# EAGLE design ballbot (EAGLE 7.2.0)
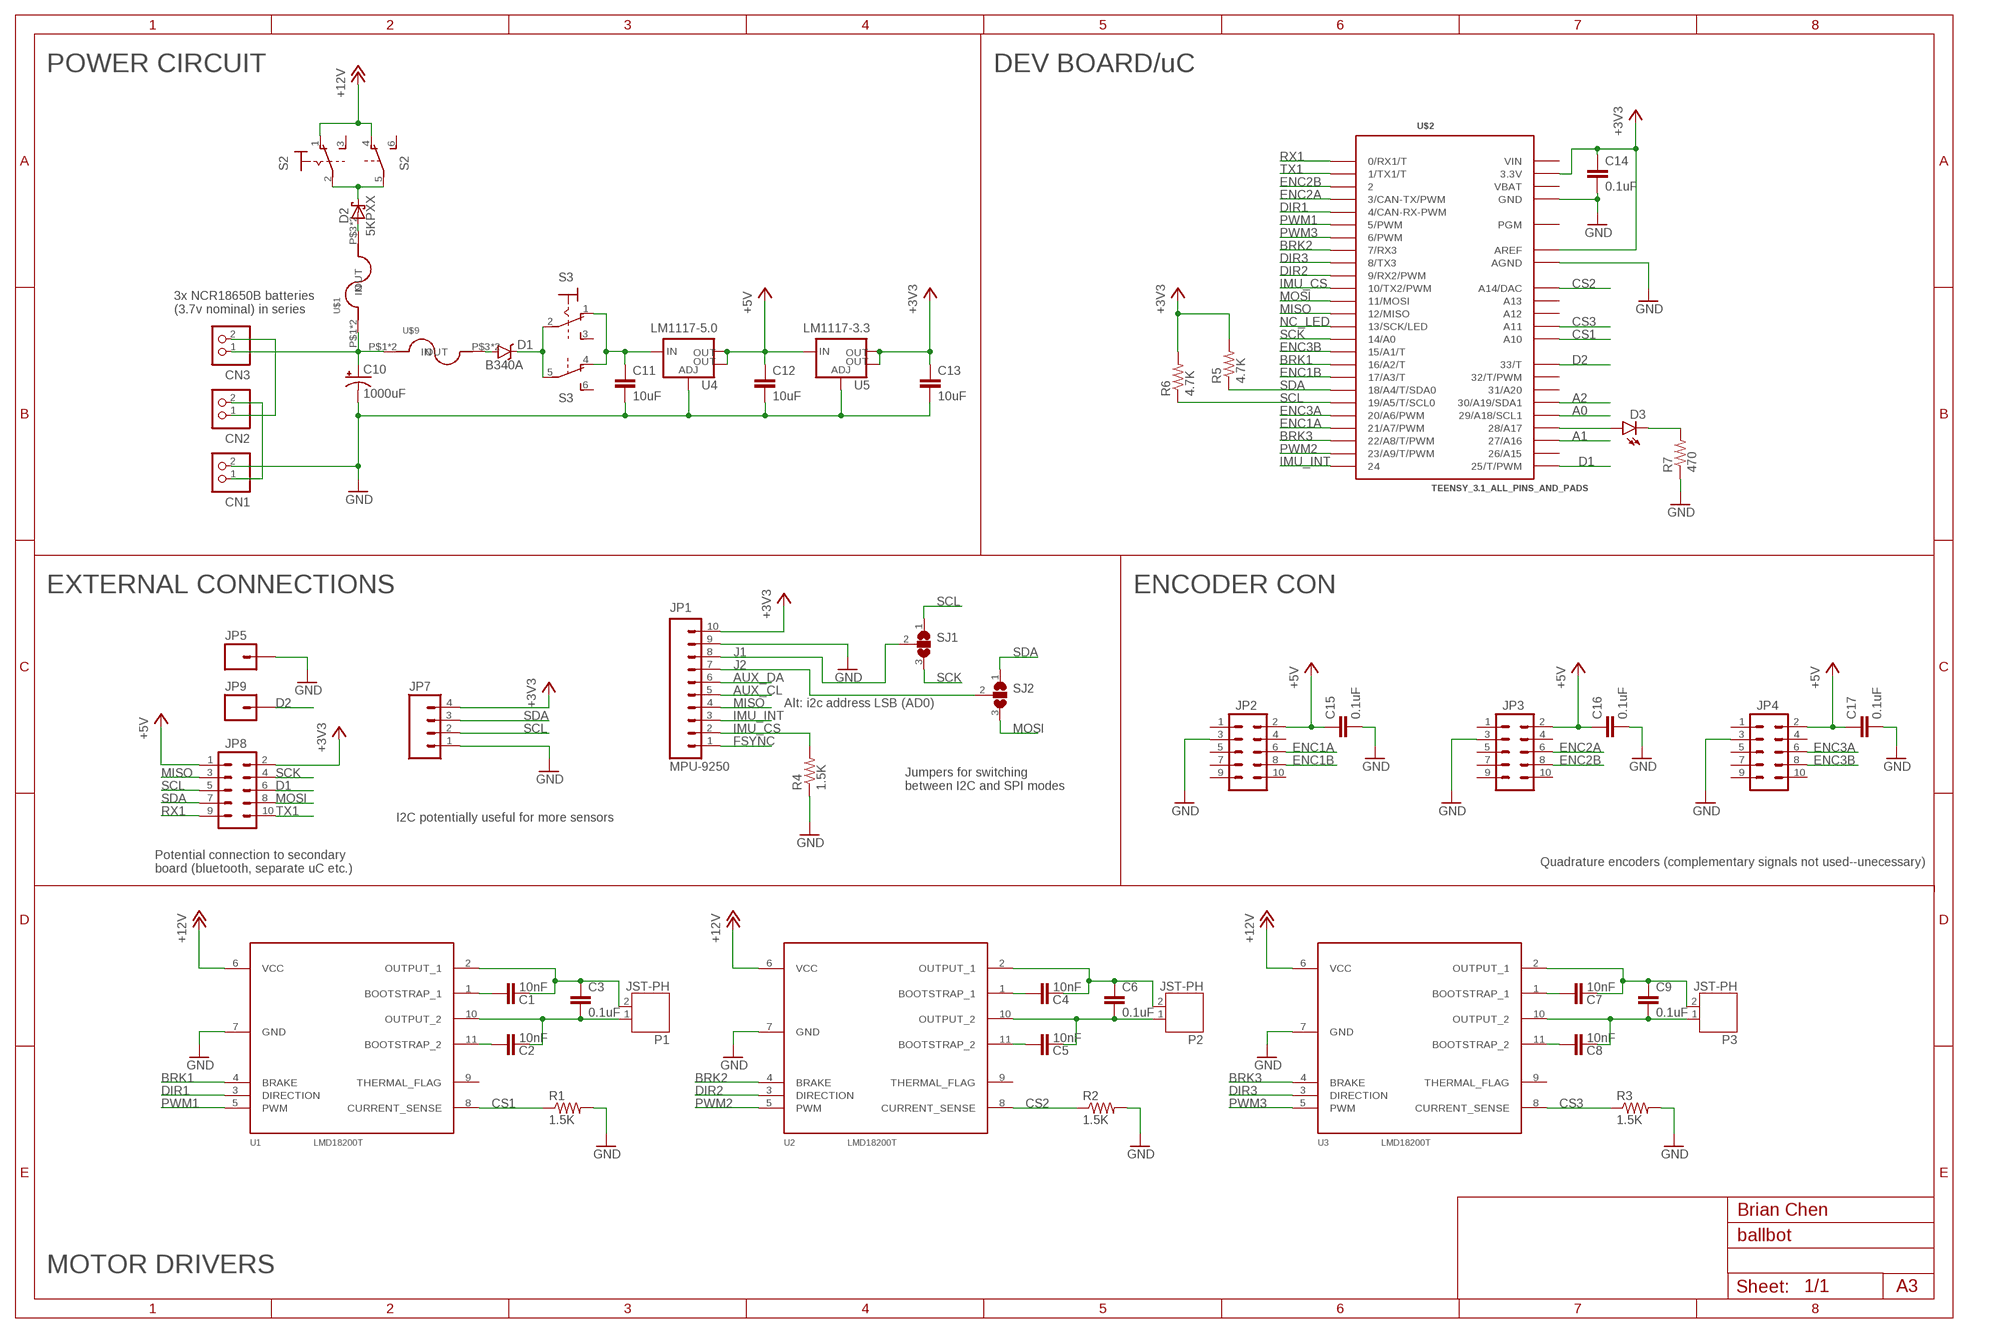
[diagram p0: schematic, sheet 1]

## Parts
C1  10nF  CAP0603-CAP  [0603-CAP]
C2  10nF  CAP0603-CAP  [0603-CAP]
C3  0.1uF  CAP0603-CAP  [0603-CAP]
C4  10nF  CAP0603-CAP  [0603-CAP]
C5  10nF  CAP0603-CAP  [0603-CAP]
C6  0.1uF  CAP0603-CAP  [0603-CAP]
C7  10nF  CAP0603-CAP  [0603-CAP]
C8  10nF  CAP0603-CAP  [0603-CAP]
C9  0.1uF  CAP0603-CAP  [0603-CAP]
C10  1000uF  1000UF-25V(PTH)  [CPOL-RADIAL-1000UF-25V]
C11  10uF  CAP0603-CAP  [0603-CAP]
C12  10uF  CAP0603-CAP  [0603-CAP]
C13  10uF  CAP0603-CAP  [0603-CAP]
C14  0.1uF  CAP0603-CAP  [0603-CAP]
C15  0.1uF  CAP0603-CAP  [0603-CAP]
C16  0.1uF  CAP0603-CAP  [0603-CAP]
C17  0.1uF  CAP0603-CAP  [0603-CAP]
CN1  B2PS-VH  [B2PS-VH]
CN2  B2PS-VH  [B2PS-VH]
CN3  B2PS-VH  [B2PS-VH]
D1  B340A  DIODE-SCHOTTKY-B340A  [SMA-DIODE]
D2  5KPXX  [P6T15]
D3  LED0603  [LED-0603]
JP1  MPU-9250  M10NO_SILK_PTH_FEMALE  [1X10_NO_SILK]
JP2  M05X2SHD  [2X5-SHROUDED]
JP3  M05X2SHD  [2X5-SHROUDED]
JP4  M05X2SHD  [2X5-SHROUDED]
JP5  M01PTH_NO_SILK_YES_STOP  [1X01_NO_SILK]
JP7  M04NO_SILK_ALL_ROUND  [1X04_NO_SILK_ALL_ROUND]
JP8  M05X2NO_SILK  [2X5_NOSILK]
JP9  M01PTH_NO_SILK_YES_STOP  [1X01_NO_SILK]
P1  JST-PH  JST-PH2  [JST-PH2]
P2  JST-PH  JST-PH2  [JST-PH2]
P3  JST-PH  JST-PH2  [JST-PH2]
R1  1.5K  RESISTOR0603-RES  [0603-RES]
R2  1.5K  RESISTOR0603-RES  [0603-RES]
R3  1.5K  RESISTOR0603-RES  [0603-RES]
R4  1.5K  RESISTOR0603-RES  [0603-RES]
R5  4.7K  RESISTOR0603-RES  [0603-RES]
R6  4.7K  RESISTOR0603-RES  [0603-RES]
R7  470  RESISTOR0603-RES  [0603-RES]
S2  320-938  [320-938]
S3  320-938  [320-938]
SJ1  SJ2W  [SJ_2]
SJ2  SJ2W  [SJ_2]
U1  LMD18200T  [TO-220-11]
U2  LMD18200T  [TO-220-11]
U3  LMD18200T  [TO-220-11]
U4  LM1117-5.0  V_REG_LM1117SOT223  [SOT223]
U5  LM1117-3.3  V_REG_LM1117SOT223  [SOT223]
U$1  FUSE_HOLDER_  [KEYSTONE_3568]
U$2  TEENSY_3.1_ALL_PINS_AND_PADS  [TEENSY3_ALL_PINS_&_PADS]
U$9  FUSE_HOLDER_  [KEYSTONE_3568]

## Nets
+3V3: C13.1 C14.1 JP1.10 JP7.4 JP8.2 R5.2 R6.2 U5.2(OUT) U5.4(OUT) U$2.3.3V U$2.3.3V1(3.3V) U$2.3.3V2(3.3V) U$2.AREF
+5V: C12.1 C15.1 C16.1 C17.1 JP2.2 JP3.2 JP4.2 JP8.1 U4.2(OUT) U4.4(OUT) U5.3(IN)
+12V: S2.1(1:O) S2.4(B:O) U1.6(VCC) U2.6(VCC) U3.6(VCC)
A0: U$2.29(29/A18/SCL1)
A1: U$2.27(27/A16)
A2: U$2.30(30/A19/SDA1)
AUX_CL: JP1.5
AUX_DA: JP1.6
BRK1: U1.4(BRAKE) U$2.16/A2(16/A2/T)
BRK2: U2.4(BRAKE) U$2.7(7/RX3)
BRK3: U3.4(BRAKE) U$2.22/A8(22/A8/T/PWM)
CS1: R1.1 U1.8(CURRENT_SENSE) U$2.A10
CS2: R2.1 U2.8(CURRENT_SENSE) U$2.RESET/DAC(A14/DAC)
CS3: R3.1 U3.8(CURRENT_SENSE) U$2.A11
D1: JP8.6 U$2.25(25/T/PWM)
D2: JP9.1 U$2.33(33/T)
DIR1: U1.3(DIRECTION) U$2.4(4/CAN-RX-PWM)
DIR2: U2.3(DIRECTION) U$2.9(9/RX2/PWM)
DIR3: U3.3(DIRECTION) U$2.8(8/TX3)
ENC1A: JP2.6 U$2.21/A7(21/A7/PWM)
ENC1B: JP2.8 U$2.17/A3(17/A3/T)
ENC2A: JP3.6 U$2.3(3/CAN-TX/PWM)
ENC2B: JP3.8 U$2.2
ENC3A: JP4.6 U$2.20/A6(20/A6/PWM)
ENC3B: JP4.8 U$2.15/A1(15/A1/T)
FSYNC: JP1.1
GND: C10.- C11.2 C12.2 C13.2 C14.2 C15.2 C16.2 C17.2 CN1.2 JP1.9 JP2.3 JP3.3 JP4.3 JP5.1 JP7.1 R1.2 R2.2 R3.2 R4.1 R7.1 U1.7(GND) U2.7(GND) U3.7(GND) U4.1(ADJ) U5.1(ADJ) U$2.AGND U$2.GND U$2.GND1(GND) U$2.GND2(GND)
IMU_CS: JP1.2 R4.2 U$2.10(10/TX2/PWM)
IMU_INT: JP1.3 U$2.24
J1: JP1.8 SJ1.2
J2: JP1.7 SJ2.2
MISO: JP1.4 JP8.3 U$2.12(12/MISO)
MOSI: JP8.8 SJ2.3 U$2.11(11/MOSI)
N$1: C1.1 U1.1(BOOTSTRAP_1)
N$2: C2.1 U1.11(BOOTSTRAP_2)
N$3: C4.1 U2.1(BOOTSTRAP_1)
N$4: C5.1 U2.11(BOOTSTRAP_2)
N$5: C7.1 U3.1(BOOTSTRAP_1)
N$6: CN1.1 CN2.2
N$7: CN2.1 CN3.2
N$8: C11.1 S3.1(1:O) S3.4(B:O) U4.3(IN)
N$9: D2.C S2.2(1:P) S2.5(B:P)
N$10: D2.A U$1.P$3(OUT) U$1.P$4(OUT)
N$11: D1.A U$9.P$3(OUT) U$9.P$4(OUT)
N$12: D3.A U$2.28(28/A17)
N$13: D1.C S3.2(1:P) S3.5(B:P)
N$14: D3.C R7.2
N$27: C8.1 U3.11(BOOTSTRAP_2)
NA: C10.+ CN3.1 U$1.P$1(IN) U$1.P$2(IN) U$9.P$1(IN) U$9.P$2(IN)
NC_LED: U$2.13(13/SCK/LED)
OUT_A1: C1.2 C3.1 P1.2 U1.2(OUTPUT_1)
OUT_A2: C4.2 C6.1 P2.2 U2.2(OUTPUT_1)
OUT_A3: C7.2 C9.1 P3.2 U3.2(OUTPUT_1)
OUT_B1: C2.2 C3.2 P1.1 U1.10(OUTPUT_2)
OUT_B2: C5.2 C6.2 P2.1 U2.10(OUTPUT_2)
OUT_B3: C8.2 C9.2 P3.1 U3.10(OUTPUT_2)
PWM1: U1.5(PWM) U$2.5(5/PWM)
PWM2: U2.5(PWM) U$2.23/A9(23/A9/T/PWM)
PWM3: U3.5(PWM) U$2.6(6/PWM)
RX1: JP8.9 U$2.0(0/RX1/T)
SCK: JP8.4 SJ1.3 U$2.14/A0
SCL: JP7.2 JP8.5 R6.1 SJ1.1 U$2.19/A5(19/A5/T/SCL0)
SDA: JP7.3 JP8.7 R5.1 SJ2.1 U$2.18/A4(18/A4/T/SDA0)
TX1: JP8.10 U$2.1(1/TX1/T)
Unconnected: JP2.1 JP2.4 JP2.5 JP2.7 JP2.9 JP2.10 JP3.1 JP3.4 JP3.5 JP3.7 JP3.9 JP3.10 JP4.1 JP4.4 JP4.5 JP4.7 JP4.9 JP4.10 S2.3(1:S) S2.6(B:S) S3.3(1:S) S3.6(B:S) U1.9(THERMAL_FLAG) U2.9(THERMAL_FLAG) U3.9(THERMAL_FLAG) U$2.26(26/A15) U$2.31(31/A20) U$2.32(32/T/PWM) U$2.A12 U$2.A13 U$2.PGM

## Notes on the sheet
- POWER CIRCUIT | DEV BOARD/uC
- 3x NCR18650B batteries
  (3.7v nominal) in series
- EXTERNAL CONNECTIONS | ENCODER CON
- Alt: i2c address LSB (AD0)
- Jumpers for switching 
  between I2C and SPI modes
- I2C potentially useful for more sensors
- Quadrature encoders (complementary signals not used--unecessary)
- Potential connection to secondary 
  board (bluetooth, separate uC etc.)
- Brian Chen
- MOTOR DRIVERS
- A3

## Power pins joined to a net without a drawn wire
VBAT: U$2.VBAT
VIN: U$2.VIN

## Library data of the parts
C1-C9 C11-C17 = SparkFun-Capacitors:CAP: Capacitor Standard 0603 ceramic capacitor, and 0.1" leaded capacitor.
C10 = SparkFun-Capacitors:1000UF-25V(PTH): CAP-08070; PROD_ID: CAP-09538; VALUE: CAP-09538
CN1-CN3 = jst-vh:B2PS-VH: Wire-to-Board 3.96mm pitch top mount connector Source: http://www.jst-mfg.com/product/pdf/jpn/VH.pdf http://www.jst-mfg.com/product/detail.php?series=262
D1 = SparkFun-DiscreteSemi:DIODE-SCHOTTKY: Schottky diodes in SFE's production catalog BAT20J 1A 23V 0.62Vf RB751 120mA 40V 0.37Vf PMEG4005EJ 0.5A 40V 0.42Vf MBRA140 1A 40V 0.5Vf B340A 3A 40V SMA; PROD_ID: DIO-09886
D2 = diode:5KPXX: DIODE transient voltage suppressor
D3 = SparkFun-LED:LED: LEDs Standard schematic elements and footprints for 5mm, 3mm, 1206, and 0603 sized LEDs. 5mm - Spark Fun Electronics SKU : COM-00529 (and others)
JP1 = SparkFun-Connectors:M10: Header 10 Standard 10-pin 0.1" header. Use with straight break away headers (SKU : PRT-00116), right angle break away headers (PRT-00553), swiss pins (PRT-00743), machine pins (PRT-00117), and female headers (PRT-00115).; PROD_ID: CONN-11563
JP2-JP4 JP8 = SparkFun-Connectors:M05X2: Header 5x2 Standard 10-pin dual row 0.1" header. Commonly used with AVR-ISP. Use with Spark Fun Electronics SKU: PRT-00778
JP5 JP9 = SparkFun-Connectors:M01: Header 1 Standard 1-pin 0.1" header. Use with straight break away headers (SKU : PRT-00116), right angle break away headers (PRT-00553), swiss pins (PRT-00743), machine pins (PRT-00117), and female headers (PRT-00115).
JP7 = SparkFun-Connectors:M04: Header 4 Standard 4-pin 0.1" header. Use with straight break away headers (SKU : PRT-00116), right angle break away headers (PRT-00553), swiss pins (PRT-00743), machine pins (PRT-00117), and female headers (PRT-00115). Molex polarized connector foot print use with SKU : PRT-08231 with associated crimp pins and housings. 1MM SMD Version SKU: PRT-10208
P1-P3 = jst-ph:JST-PH2
R1-R7 = SparkFun-Passives:RESISTOR: Resistor Basic schematic elements and footprints for 0603, 1206, and PTH resistors.
S2 S3 = SWITCH DPDT MTS-202:320-938: TOGGLE SWITCH distributor RS Components
SJ1 SJ2 = jumper:SJ2W: SMD solder JUMPER
U1-U3 = lmd1820x:LMD18200: National Semiconductor LMD18200 3A, 55V H-Bridge
U4 U5 = SparkFun-PowerIC:V_REG_LM1117: Voltage Regulator LM1117 Standard adjustable voltage regulator but in SMD form. Spark Fun Electronics SKU : COM-00595; PROD_ID: VREG-08170
U$1 U$9 = Andrew:FUSE_HOLDER
U$2 = Teensy_3_NOVBAT:TEENSY_3.1_ALL_PINS_AND_PADS: Footprint for Teensy 3.1 or 3.2 board using all pads and all through-holes. Pads need a 2x7 0.1" SMD header.

## Board
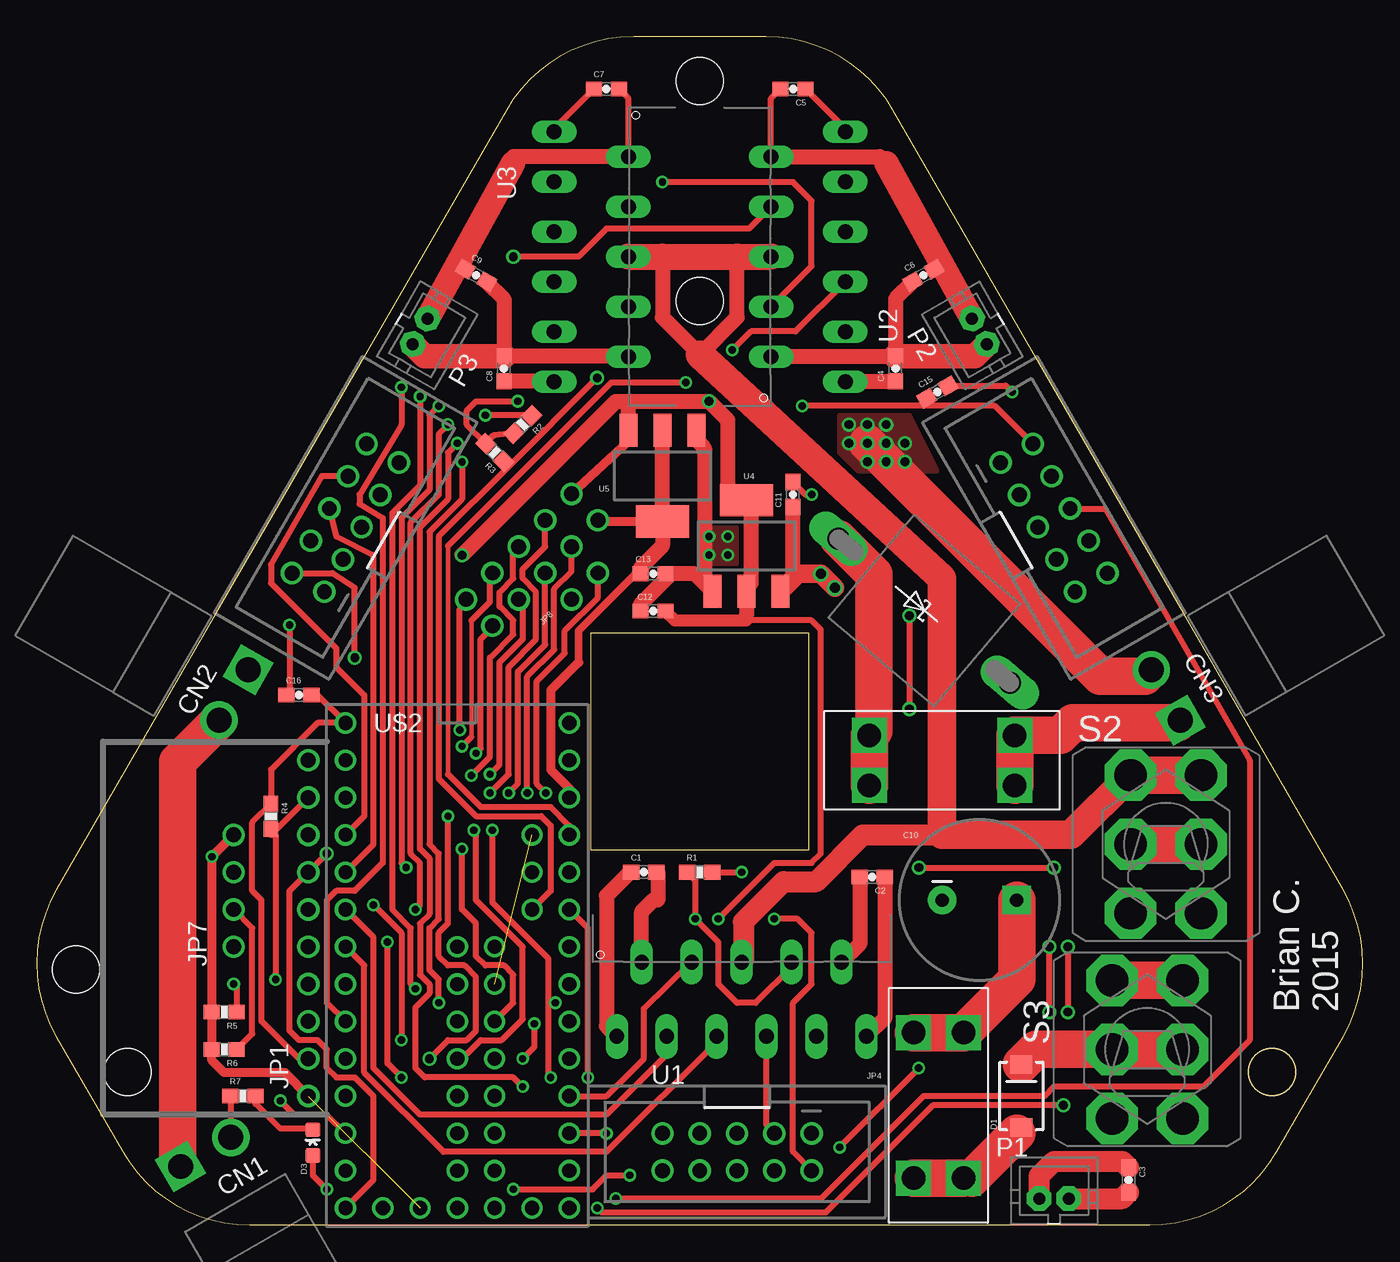
[diagram p1: board, top side]
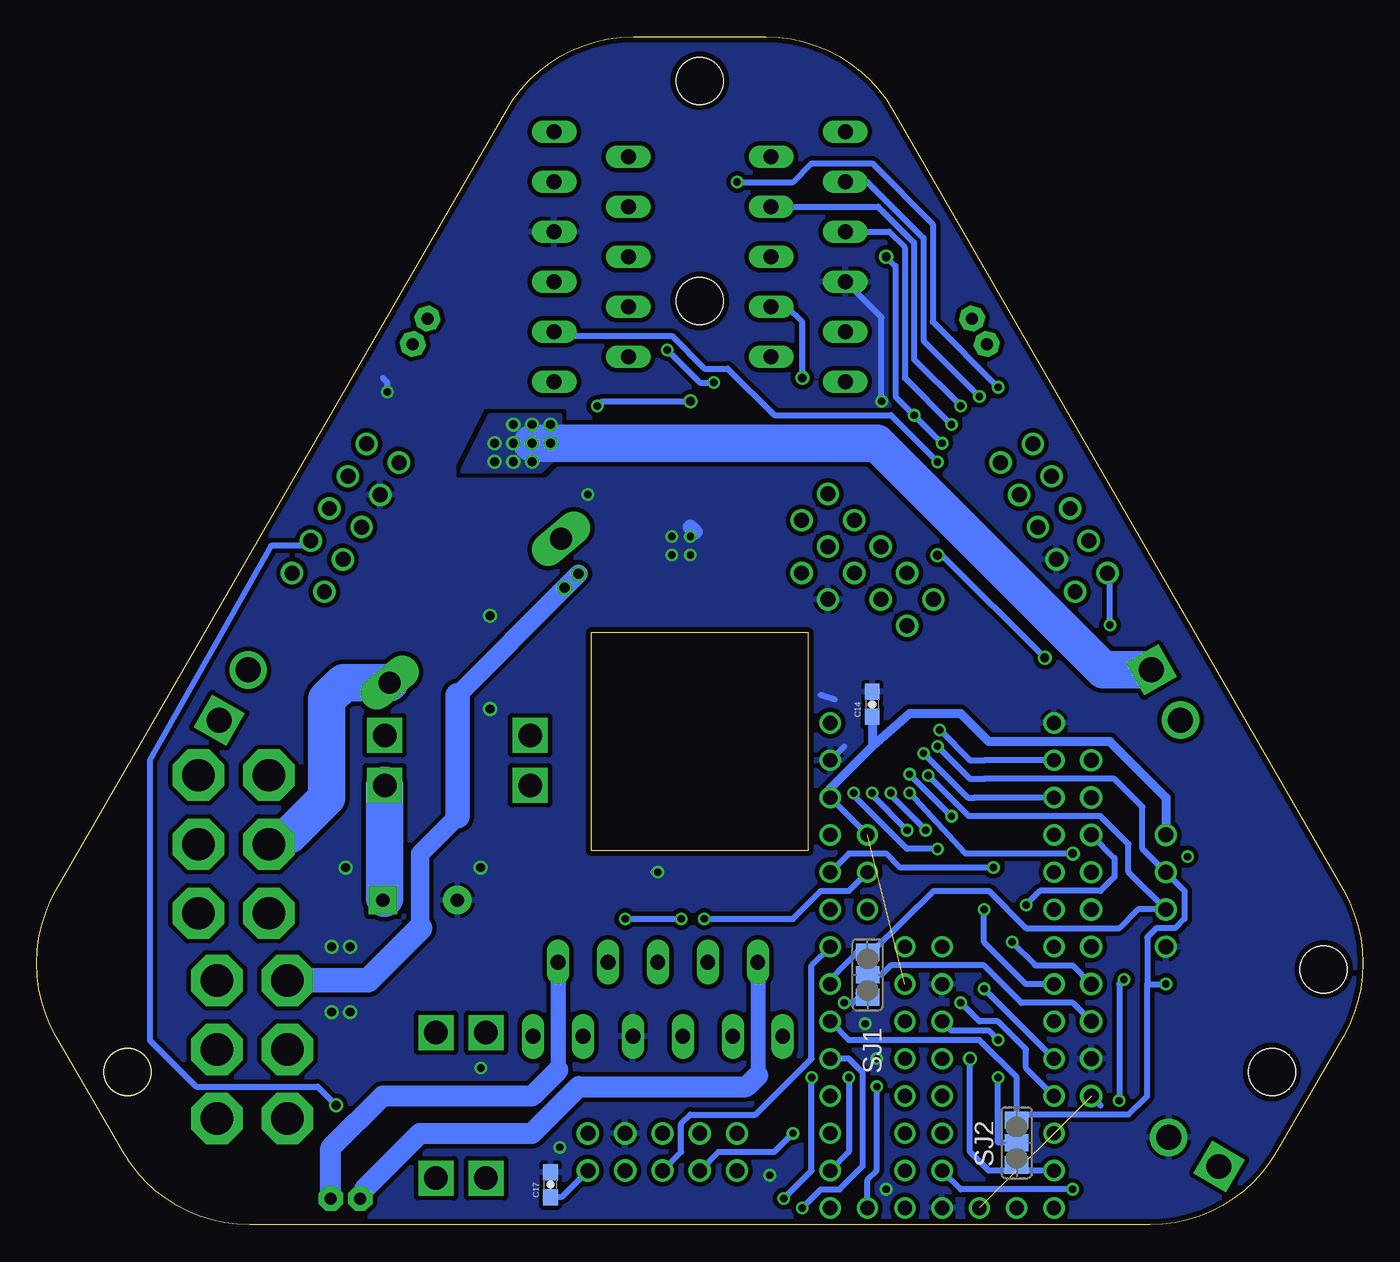
[diagram p2: board, bottom side, seen from below]

Size 90.33 x 80.91 mm. Coordinates in mm from the lower left corner, seen from the top.
Outline: 52.56,25.51 37.76,25.51 37.76,40.31 52.56,40.31 52.56,25.51
Outline: 1.34,12.81 5.85,5 arc60 14.51,0 75.82,0 arc60 84.48,5 88.99,12.81 arc60 88.99,22.81 58.34,75.91 arc60 49.68,80.91 40.65,80.91 arc60 31.99,75.91 1.34,22.81 arc60 1.34,12.81
Outline: circle at 84.14,10.41 radius 1.6
Copper layers (1*16): Top 0.0356mm / dielectric 1.5011mm / Bottom 0.0356mm
Design rules "LaenPCBOrder *": minimum track width 6mil, minimum drill 13mil, track to track 8mil, track to pad 8mil, pad to pad 8mil, via to via 8mil, smd to smd 8mil, copper to edge 15mil, drill to drill 6mil, minimum pad ring 7mil, minimum via ring 7mil, stop-mask expansion 3mil, vias tented up to drill 24mil, thermal gap 10mil
Holes 3.2 mm at 45.16,77.91 6.19,10.41 84.14,10.41 45.16,62.91 2.66,17.41

### Footprints (pad centres in the part's own frame; a part is rotated, then mirrored left to right if it is on the bottom)
0603-CAP = smd 1.1 x 1: 1 -0.85,0; 2 0.85,0
CPOL-RADIAL-1000UF-25V = drill 0.9 pad 1.93 square: + 2.54,0 | drill 0.9 pad 1.93: - -2.54,0
B2PS-VH = drill 1.7 square: 1 1.98,0 | drill 1.7: 2 -1.98,0
SMA-DIODE = smd 1.27 x 1.47: A -2.15,0; C 2.15,0
P6T15 = drill 1.499 long: A 7.62,0; C -7.62,0
LED-0603 = smd 1 x 1: A 0,-0.877; C 0,0.877
1X10_NO_SILK = drill 1.016: 1 0,0; 2 2.54,0; 3 5.08,0; 4 7.62,0; 5 10.16,0; 6 12.7,0; 7 15.24,0; 8 17.78,0; 9 20.32,0; 10 22.86,0
2X5-SHROUDED = drill 1.016: 1 -1.27,5.08; 2 1.27,5.08; 3 -1.27,2.54; 4 1.27,2.54; 5 -1.27,0; 6 1.27,0; 7 -1.27,-2.54; 8 1.27,-2.54; 9 -1.27,-5.08; 10 1.27,-5.08
1X01_NO_SILK = drill 1.016: 1 0,0
1X04_NO_SILK_ALL_ROUND = drill 1.016: 1 0,0; 2 2.54,0; 3 5.08,0; 4 7.62,0
2X5_NOSILK = drill 1.016: 1 -1.27,5.08; 2 1.27,5.08; 3 -1.27,2.54; 4 1.27,2.54; 5 -1.27,0; 6 1.27,0; 7 -1.27,-2.54; 8 1.27,-2.54; 9 -1.27,-5.08; 10 1.27,-5.08
JST-PH2 = drill 0.813 pad 1.676 octagon: 1 1,0; 2 -1,0
0603-RES = smd 1.1 x 1: 1 -0.85,0; 2 0.85,0
320-938 = drill 2.2 pad 3.5 octagon: 1 -2.4,4.7; 2 -2.4,0; 3 -2.4,-4.7; 4 2.4,4.7; 5 2.4,0; 6 2.4,-4.7
SJ_2 = smd 1.168 x 1.6: 1 -1.524,0; 2 0,0; 3 1.524,0
TO-220-11 = drill 1.016 long: 1 -8.509,-2.292; 2 -6.807,2.762; 3 -5.105,-2.292; 4 -3.404,2.762; 5 -1.702,-2.292; 6 0,2.762; 7 1.702,-2.292; 8 3.404,2.762; 9 5.105,-2.292; 10 6.807,2.762; 11 8.509,-2.292
SOT223 = smd 1.219 x 2.235: 1 -2.311,-3.099; 2 0,-3.099; 3 2.311,-3.099 | smd 3.6 x 2.2: 4 0,3.099
KEYSTONE_3568 = drill 1.6 square: P$1 -4.953,1.702; P$2 -4.953,-1.702; P$3 4.953,1.702; P$4 4.953,-1.702
TEENSY3_ALL_PINS_&_PADS = drill 0.965: 0 -7.62,13.97; 1 -7.62,11.43; 2 -7.62,8.89; 3 -7.62,6.35; 3.3V 7.62,11.43; 3.3V1 -2.54,-16.51; 3.3V2 2.54,-1.27; 4 -7.62,3.81; 5 -7.62,1.27; 6 -7.62,-1.27; 7 -7.62,-3.81; 8 -7.62,-6.35; 9 -7.62,-8.89; 10 -7.62,-11.43; 11 -7.62,-13.97; 12 -7.62,-16.51; 13 7.62,-16.51; 14/A0 7.62,-13.97; 15/A1 7.62,-11.43; 16/A2 7.62,-8.89; 17/A3 7.62,-6.35; 18/A4 7.62,-3.81; 19/A5 7.62,-1.27; 20/A6 7.62,1.27; 21/A7 7.62,3.81; 22/A8 7.62,6.35; 23/A9 7.62,8.89; 24 0,-3.81; 25 0,-6.35; 26 0,-8.89; 27 0,-11.43; 28 0,-13.97; 29 2.54,-13.97; 30 2.54,-11.43; 31 2.54,-8.89; 32 2.54,-6.35; 33 2.54,-3.81; A10 5.08,6.35; A11 5.08,3.81; A12 0,1.27; A13 2.54,1.27; AGND 7.62,13.97; AREF 5.08,8.89; GND -7.62,16.51; GND1 0,-16.51; GND2 0,-1.27; PGM 2.54,-16.51; RESET/DAC 5.08,-16.51; VBAT -5.08,-16.51; VIN 7.62,16.51

### Placement (x,y rotation side)
C1  41.35,24.02 0 top
C2  56.91,23.7 180 top
C3  74.37,3.06 270 top
C4  58.5,58.31 90 top
C5  51.51,77.36 180 top
C6  60.4,64.66 30 top
C7  38.81,77.36 0 top
C8  31.83,58.31 90 top
C9  29.92,64.66 330 top
C10  64.21,22.11 0 top
C11  51.51,49.73 90 top
C12  41.99,41.8 180 top
C13  41.99,44.34 0 top
C14  33.42,35.45 90 bottom
C15  61.36,56.72 30 top
C16  17.86,36.08 0 top
C17  55.32,2.74 90 bottom
CN1  11.51,4.97 210 top
CN2  13.41,36.08 60 top
CN3  76.91,36.08 300 top
D1  67.07,8.78 90 top
D2  60.46,41.83 140 top
D3  18.81,5.6 0 top
JP1  18.49,31.64 270 top
JP2  69.29,48.15 30 top
JP3  21.03,48.15 150 top
JP4  47.7,4.97 270 top
JP5  36.43,42.6 315 top
JP7  13.41,18.94 90 top
JP8  33.73,45.29 315 top
JP9  38.22,44.39 315 top
P1  69.29,1.79 0 top
P2  64.21,60.85 120 top
P3  26.11,60.85 240 top
R1  45.16,24.02 0 top
R2  33.1,54.5 225 top
R3  31.19,52.59 135 top
R4  15.95,27.83 270 top
R5  12.78,14.49 180 top
R6  12.78,11.95 180 top
R7  14.05,8.78 0 top
S2  76.91,25.92 0 top
S3  75.64,11.95 0 top
SJ1  33.73,17.03 270 bottom
SJ2  23.57,5.6 270 bottom
U1  48.02,15.13 0 top
U2  52.78,65.93 90 top
U3  37.54,65.93 270 top
U4  48.34,46.24 0 top
U5  42.62,51 180 top
U$1  61.67,31.64 180 top
U$2  28.65,17.67 0 top
U$9  61.43,8.14 270 top

### Tracks (layer width: path | path; a pad name or v marks a point on that pad's centre or on a via)
+3V3  (via drill 0.5)  (2 unrouted)
  Top 0.406: JP8.2 38.3,47.9
  Top 0.508: 40.8,44.34 36.91,40.45 36.91,38.3
  Top 0.61: JP7.4 v11.93,25.07 R5.2 R6.2 11.93,11.21 12.78,10.36 16.91,10.36 JP1.10 | 38.3,47.9 U5.4 | C13.1 40.8,44.34 | 36.91,38.3 35,36.4 35,31 36.27,29.73 U$2.3.3V
  Top 1.016: U5.2 U5.4 42.62,46.24 41.14,44.76 C13.1
  Bottom 0.406: U$2.3.3V U$2.AREF | 17.86,8.14 JP1.10
  Bottom 0.61: JP7.4 13.41,29.1 17.22,32.91 25.48,32.91 27.38,34.81 30.88,34.81 33.42,32.59 | 33.42,32.59 36.27,29.73 U$2.3.3V | C14.1 33.42,32.59
+5V  (via drill 0.5, 0.6)
  Top 0.406: JP2.2 65.27,55.77 60.4,55.77 | 60.4,55.77 v52.15,55.77 | v21.67,38.62 21.67,43.38 20.13,44.38 JP3.2 | JP4.2 51.51,4.97 51.51,15.13 52.78,16.4 52.78,19.89 51.83,20.84 v50.24,20.84 | v46.43,20.84 50.24,24.65 52.78,24.65 53.42,25.29 53.42,40.53 52.78,41.16 48.34,41.16 48.34,41.48 | C15.1 60.3,55.98 60.4,55.77 | v17.22,40.84 17.22,36.18 C16.1
  Top 0.61: JP8.1 40.31,53.35 U5.3
  Top 0.813: 48.34,41.16 43.47,41.16 C12.1
  Top 1.016: 40.3,56.08 v45.8,56.08 47.07,54.81 47.07,49.42 48.26,49.42 U4.4 48.66,49.02 48.66,43.7 48.34,43.38 U4.2 48.34,41.48 | v28.97,45.61 39.45,56.08 40.3,56.08 | U5.3 40.3,53.8 40.3,56.08
  Bottom 0.406: v52.15,55.77 51.83,56.08 v45.8,56.08 | v28.97,45.61 28.65,45.61 v21.67,38.62 | v50.24,20.84 v46.43,20.84 | JP4.2 54.59,1.89 C17.1 | v17.22,40.84 17.22,44.21 JP3.2
+12V
  Top 1.016: 42.62,65.93 42.62,61.8 45.16,59.26 47.7,61.8 47.7,65.93
  Top 1.422: 61.67,26.56 56.28,26.56 53.1,23.38 50.88,23.38 48.13,20.63 48.13,18 U1.6
  Top 1.778: U3.6 42.62,65.93 47.7,65.93 U2.6
  Top 1.93: S2.1 70.45,26.56 61.67,26.56 61.67,44.02 45.16,59.26
  Top 2.54: S2.4 S2.1
BRK1
  Top 0.406: U$2.16/A2 38.81,8.78 41.35,11.32 41.35,14.73 U1.4
BRK2  (via drill 0.5)
  Top 0.406: U2.4 52.78,65.29 52.78,69.74 51.51,71.01 v42.62,71.01 | v24.84,57.04 24.84,54.5 21.99,49.73 21.99,49.1 23.57,48.15 23.57,24.65 21.67,22.75 20.4,22.75 19.76,22.11 19.76,15.13 U$2.7
  Bottom 0.406: v42.62,71.01 38.81,71.01 37.54,72.28 33.42,72.28 29.29,68.15 29.29,61.48 v24.84,57.04
BRK3  (via drill 0.5)
  Top 0.406: v27.38,55.77 26.75,55.13 26.75,50.05 24.84,48.15 24.84,24.65 v25.16,24.33
  Bottom 0.406: U3.4 33.01,69.33 30.56,66.88 30.56,58.94 v27.38,55.77 | v25.16,24.33 31.51,24.33 32.46,25.29 35,25.29 U$2.22/A8
CS1  (via drill 0.5)
  Top 0.406: U1.8 51.53,17.69 48.97,15.13 47.7,15.13 46.43,16.4 46.43,19.25 v44.85,20.84 44.85,23.48 R1.1
  Bottom 0.406: v44.85,20.84 38.81,20.84 36.91,22.75 35,22.75 U$2.A10
CS2  (via drill 0.5, 0.6)
  Top 0.406: U2.8 48.52,67.83 38.81,67.83 36.91,65.93 v32.46,65.93 | v28.65,53.23 28.02,52.59 28.02,49.42 26.11,47.51 26.11,25.6 26.75,24.97 26.75,21.16 26.11,20.52 26.11,17.03 26.75,16.4 26.75,15.76 25.8,14.81 25.8,10.68 26.43,10.05 32.46,10.05 v33.1,9.41 | R2.1 33.67,55.13 v30.56,55.13
  Bottom 0.406: v32.46,65.93 31.83,65.29 31.83,56.4 v30.56,55.13 v28.65,53.23 | U$2.RESET/DAC 33.73,3.06 33.1,3.7 v33.1,9.41
CS3  (via drill 0.6)
  Top 0.406: v38.18,57.67 32.15,51.64 | 32.15,51.64 27.38,46.88 27.38,30.37 29.92,27.83 34.37,27.83 35,27.19 35,22.75 U$2.A11 | R3.1 32.15,51.64
  Bottom 0.406: v38.18,57.67 38.18,61.48 39.22,62.52 U3.8
D1  (via drill 0.5)
  Top 0.406: v29.77,26.87 29.92,26.72 29.92,22.11 33.1,18.94 33.1,14.02 31.67,12.59 30.24,12.59 28.97,11.32 U$2.25 | v32.15,29.41 32.78,30.05 32.78,37.67 34.63,39.52 JP8.6
  Bottom 0.406: v29.77,26.87 32.15,29.26 v32.15,29.41
D2  (via drill 0.5)
  Top 0.406: U$2.33 32.46,15.13 32.46,17.03 31.83,17.67 30.56,17.67 29.92,18.3 29.92,20.52 28.97,21.48 v28.97,25.6 | v34.69,29.41 34.05,30.05 34.05,37.03 35.96,38.94 35.96,40.45 38.22,42.71 JP9.1
  Bottom 0.406: v28.97,25.6 31.04,25.6 34.69,29.26 v34.69,29.41
DIR1
  Top 0.406: U1.3 43.02,11.72 38.81,7.51 26.11,7.51 22.94,10.68 22.94,19.57 U$2.4
DIR2  (via drill 0.5)
  Top 0.406: v28.97,51.96 28.97,49.42 26.75,47.19 26.75,25.92 27.38,25.29 27.38,20.84 26.75,20.21 26.75,17.35 27.38,16.71 v27.38,15.13
  Bottom 0.406: U2.3 55.05,60.85 54.69,60.53 47.07,60.53 44.85,58.31 43.26,58.31 40.08,55.13 32.15,55.13 v28.97,51.96 | U$2.9 22.94,10.68 22.94,11.95 24.84,13.86 26.11,13.86 v27.38,15.13
DIR3  (via drill 0.5)
  Top 0.406: v26.11,56.4 26.11,50.37 24.21,48.46 24.21,21.48 25.48,20.21 25.48,16.4 v25.8,16.08
  Bottom 0.406: U3.3 35.23,71.01 33.73,71.01 29.92,67.2 29.92,60.21 v26.11,56.4 | U$2.8 v25.8,16.08
ENC1A  (via drill 0.5)
  Top 0.406: JP2.6 72.79,48.78 82.63,31.64 82.63,12.59 79.45,9.41 69.29,9.41 68.66,8.78 60.4,8.78 53.42,1.79 v39.45,1.79 | v37.54,10.05 37.54,20.21 U$2.21/A7
  Bottom 0.406: v39.45,1.79 37.54,3.7 v37.54,10.05
ENC1B  (via drill 0.5, 0.6)
  Top 0.406: v69.93,8.14 61.04,8.14 53.74,0.84 38.5,0.84 v38.18,1.16
  Bottom 0.406: JP2.8 72,46.24 74.37,46.24 82.63,31.64 82.63,12.59 79.45,9.41 71.2,9.41 v69.93,8.14 | v38.18,1.16 36.91,2.43 35.64,2.43 34.05,4.01 34.05,10.36 35,11.32 U$2.17/A3
ENC2A
  Top 0.406: JP3.6 20.4,46.88 22.94,45.61 22.94,25.92 U$2.3
ENC2B
  Top 0.406: JP3.8 19.42,50.98 15.95,44.97 15.95,43.7 20.4,39.26 20.4,37.99 22.3,36.08 22.3,27.83 U$2.2
ENC3A
  Bottom 0.406: JP4.6 46.43,4.97 46.43,6.87 45.8,7.51 41.35,7.51 37.54,11.32 37.54,17.67 U$2.20/A6
ENC3B  (via drill 0.5)
  Top 0.406: v38.81,6.24 U$2.15/A1
  Bottom 0.406: JP4.8 43.89,4.97 40.08,4.97 v38.81,6.24
GND  (via drill 0.5, 0.6)
  Top 0.254: v45.8,45.61 45.48,45.29 45.48,44.65
  Top 0.406: JP4.3 49.72,6.76 U1.7 | R3.2 31.16,53.76 R2.2 31.09,53.76 30.56,53.23 29.29,54.5 29.29,55.45 29.92,56.08 v32.78,56.08 | JP1.9 17.86,11.32 15.32,13.86 15.32,22.11 14.68,22.75 14.68,27.41 R4.1 15.95,31 19.13,34.18 U$2.GND 19.13,36.08 C16.2 | C15.2 66.01,57.14 v66.44,56.72 | C11.2 52.36,49.73 v52.78,49.73 | R1.2 v48.02,24.02 | v33.89,13.7 33.89,12.11 v33.1,11.32 | v32.46,2.43 37.86,2.43 38.81,3.38 v40.4,3.38 | v54.69,5.28 v60.09,10.68 | R7.1 13.22,8.43 CN1.2 | v60.09,24.33 v69.29,24.33 | v68.98,14.49 v68.98,18.94 | v70.25,18.94 v70.25,14.49 | v59.45,41.48 v59.45,35.13
  Top 1.016: U4.1 45.48,43.69 | U5.1 44.94,53.46 45.48,52.91 45.48,44.65 45.48,43.69 | 45.48,43.69 44.83,44.34 C13.2 43,44.13 41.14,42.27 C12.2
  Bottom 0.406: v32.78,56.08 32.78,61.8 35,64.02 | v66.44,56.72 66.44,57.35 66.75,57.67 | 35.96,35.76 36.91,36.08 | v48.02,24.02 48.34,24.02 | U$2.AGND 35.32,32.59
  Bottom 1.016: 45.48,47.19 45.8,47.51
  other vias: 45.8,46.88 47.07,46.88 47.07,45.61
  pour Bottom (isolate 0.305, rank 2): -9.45,86.25 98.5,86.25 99.77,-5.19 -9.45,-5.19
  pour Top: 45.16,47.51 47.7,47.51 47.7,44.97 45.16,44.97
IMU_CS  (via drill 0.5)
  Top 0.406: JP1.2 15.95,26.56 | 15.95,26.56 16.27,26.56 v16.27,16.71 | R4.2 15.95,26.56 | U$2.10 19.76,7.51 17.54,7.51 v16.59,8.46
  Bottom 0.406: v16.27,16.71 16.59,16.4 v16.59,8.46
IMU_INT  (via drill 0.5)
  Top 0.406: v22.94,21.79 24.84,19.89 v24.84,12.59
  Bottom 0.406: v24.84,12.59 25.48,13.22 28.02,13.22 U$2.24 | JP1.3 16.91,24.97 16.91,23.7 17.86,22.75 21.99,22.75 v22.94,21.79
J1
  Bottom 0.406: JP1.8 19.76,15.13 23.26,15.13 25.8,17.67 32.15,17.67 32.78,17.03 SJ1.2
J2  (via drill 0.5)
  Top 0.406: v24.84,10.05 23.89,11 v23.89,19.25
  Bottom 0.406: SJ2.2 24.84,5.6 v24.84,10.05 | v23.89,19.25 22.3,17.67 19.76,17.67 JP1.7
MISO  (via drill 0.5, 0.6)
  Top 0.406: U$2.12 22.94,3.06 22.94,8.78 21.67,10.05 20.4,10.05 19.76,10.68 19.76,11.95 19.13,12.59 17.86,12.59 17.22,13.22 17.22,22.75 JP1.4 v19.76,25.29 | v30.88,29.41 32.15,30.68 32.15,37.99 34.01,39.89 34.01,43.07 33.1,44.02 33.1,44.65 34.63,46.19 JP8.3
  Bottom 0.406: v19.76,25.29 27.07,25.29 v30.88,29.41
MOSI  (via drill 0.5, 0.6)
  Top 0.406: v26.75,11.32 28.02,12.59 29.29,12.59 29.92,13.22 29.92,16.87 29.13,17.67 28.02,17.67 27.38,18.3 27.38,19.89 28.02,20.52 v28.02,27.83 | v30.88,30.68 31.51,31.32 31.51,38.3 33.1,39.89 33.1,42.43 32.94,42.59 JP8.8
  Bottom 0.406: U$2.11 23.32,3.7 SJ2.3 23.96,3.7 25.48,3.7 26.75,4.97 v26.75,11.32 | v30.88,30.68 v28.02,27.83
N$1
  Top 1.016: C1.1 40.4,24.02 38.81,22.43 38.81,13.53 U1.1
N$2
  Top 1.016: C2.1 57.76,14.07 U1.11
N$3
  Top 1.016: U2.1 55.12,57.46 C4.1
N$4
  Top 0.406: U2.11 55.08,74.64 C5.1
N$5
  Top 0.406: U3.1 35.25,74.64 C7.1
N$6
  Top 2.54: CN2.2 9.6,31.55 9.6,4.33 CN1.1
N$7  (via drill 0.6)
  Top 2.54: v56.59,53.23 72.47,37.35 75.48,37.35 CN3.2
  Bottom 2.54: v56.59,53.23 33.1,53.23 17.67,37.8 CN2.1
  other vias: 55.32,54.5 55.32,53.23 59.13,53.23 57.86,51.96 57.86,53.23 57.86,54.5 56.59,54.5 56.59,51.96 59.13,51.96
  pour Top: 59.45,55.13 61.36,51.32 55.96,51.32 54.69,52.59 54.69,55.13
  pour Bottom: 54.69,55.13 54.69,52.59 55.96,51.32 61.36,51.32 59.45,55.13
N$8  (via drill 0.7)
  Top 1.016: U4.3 51.51,44.01 C11.1
  Top 1.27: v54.37,43.38 v53.42,44.34 51.84,44.34 U4.3
  Top 2.54: S3.1 S3.4
  Bottom 1.27: 64.21,20.21 64.21,25.29 61.67,27.83 | 61.67,36.08 v54.37,43.38 v53.42,44.34
  Bottom 1.676: S3.1 67.77,16.65 64.21,20.21 | 61.67,27.83 61.67,36.08
N$9
  Top 2.54: S2.5 S2.2
  Bottom 2.54: S2.2 73.1,26.56 70.56,29.1 70.56,35.78 69.41,36.93 D2.C
N$10
  Top 1.016: 56.59,33.47 U$1.P$4
  Top 2.54: U$1.P$3 U$1.P$4 57.04,33.66 57.04,44.3 D2.A
N$11
  Top 1.016: U$9.P$3 63.7,3.18 | 66.75,6.24 D1.A
  Top 2.54: U$9.P$3 U$9.P$4 | 63.7,3.18 66.75,6.24
N$12  (via drill 0.5)
  Top 0.406: D3.A 18.81,3.38 v19.76,2.43
  Bottom 0.406: v19.76,2.43 27.38,2.43 U$2.28
N$13
  Top 2.54: D1.C 68.1,11.95 S3.2 S3.5
N$14
  Top 0.406: 18.78,6.45 D3.C 18.74,6.55 16.59,6.55 14.9,8.24 R7.2
N$27
  Top 1.016: U3.11 35.21,57.46 C8.1
NA
  Top 2.54: U$9.P$2 U$9.P$1 66.75,16.72 C10.+ | U$1.P$1 U$1.P$2 69.73,33.34 70.56,34.18 77.71,34.18 CN3.1
  Bottom 1.016: 66.63,22.24 C10.+
  Bottom 2.54: U$1.P$1 66.63,22.24
OUT_A1
  Top 1.016: C1.2 42.31,24.02 42.31,22.11 41.99,22.11 41.21,21.34 U1.2
  Top 1.422: P1.2 68.29,3.33 69.29,4.33 73.95,4.33 C3.1
  Bottom 1.016: P1.2 68.02,2.43 | U1.2 41.21,10.19
  Bottom 1.422: 68.02,2.43 64.21,6.24 56.59,6.24 53.42,9.41 41.99,9.41 41.21,10.19
OUT_A2
  Top 1.016: U2.2 50.06,59.16 C4.2 58.5,63.06 C6.1
  Top 1.676: C4.2 63.89,59.16 P2.2
OUT_A3
  Top 0.406: U3.2 40.31,76.72 C7.2 | C9.1 26.61,62.51 P3.2
  Top 1.016: U3.2 32.46,72.73 32.46,72.28
  Top 1.676: 32.46,72.28 P3.2
OUT_B1
  Top 1.016: C2.2 56.06,19.12 U1.10
  Top 1.422: P1.1 73.95,1.79 C3.2
  Bottom 1.016: U1.10 54.83,10.54
  Bottom 1.422: P1.1 70.29,5.24 66.75,8.78 56.59,8.78 54.83,10.54
OUT_B2
  Top 0.406: U2.10 50.02,76.72 C5.2 | C6.2 63.71,62.51 P2.1
  Top 1.016: U2.10 57.41,72.73 57.86,72.28
  Top 1.676: 57.86,72.28 P2.1
OUT_B3
  Top 1.016: U3.10 40.27,59.16 C8.2 31.83,63.06 C9.2
  Top 1.676: C8.2 26.44,59.16 P3.1
PWM1
  Top 0.406: U1.5 46.43,12.58 38.81,4.97 27.7,4.97 22.3,10.36 22.3,17.67 U$2.5
PWM2  (via drill 0.5)
  Top 0.305: 28.02,46.24 28.02,30.68
  Top 0.406: U2.5 51.7,60.85 48.66,60.85 v47.39,59.58 | v44.21,57.35 39.13,57.35 28.02,46.24 | 28.02,30.68 30.24,28.46 35,28.46 36.27,27.19 U$2.23/A9
  Bottom 0.406: v47.39,59.58 45.16,57.35 v44.21,57.35
PWM3  (via drill 0.5)
  Top 0.406: v28.02,54.5 27.38,53.86 27.38,49.73 25.48,47.83 25.48,25.29 26.11,24.65 26.11,21.79 v25.8,21.48
  Bottom 0.406: U3.5 32.26,67.63 31.19,66.56 31.19,57.67 v28.02,54.5 | U$2.6 22.94,16.4 25.8,19.25 v25.8,21.48
RX1  (via drill 0.5)
  Top 0.406: v28.81,33.7 28.81,41.96 29.24,42.39 JP8.9
  Bottom 0.406: U$2.0 25.8,31.64 26.75,31.64 v28.81,33.7
SCK  (via drill 0.5)
  Top 0.406: v35,10.05 34.85,10.21 34.85,15.13 | v31.04,26.87 31.04,21.95 34.85,18.14 34.85,15.13 | v33.42,29.41 33.42,37.35 35.24,39.18 35.24,43.3 36.43,44.49 JP8.4 | v35.32,15.13 34.85,15.13
  Bottom 0.406: v35,10.05 35,4.97 U$2.14/A0 | 34.37,15.51 34.37,15.76 SJ1.3 34.37,15.51 | v31.04,26.87 33.42,29.26 v33.42,29.41 | 34.37,15.51 34.75,15.13 v35.32,15.13
SCL  (via drill 0.5)
  Top 0.406: R6.1 14.68,13.01 14.68,20.21 JP7.2 | v29.61,30.6 30.88,31.87 30.88,38.62 32.46,40.21 32.46,41.16 31.51,42.11 31.51,43.07 32.46,44.02 32.46,45.92 32.73,46.19 JP8.5
  Bottom 0.406: U$2.19/A5 36.27,16.71 34.12,18.94 SJ1.1 33.48,18.56 33.42,18.62 29.23,22.75 25.48,22.75 22.94,20.21 16.59,20.21 15.32,21.48 JP7.2 15.95,24.02 15.95,25.92 17.86,27.83 26.83,27.83 v29.61,30.6
SDA  (via drill 0.5)
  Top 0.305: 29.61,33.22 29.61,41.16
  Top 0.406: v13.41,16.4 13.63,16.18 R5.1 | v28.97,32.59 29.61,33.22 | 29.61,41.16 30.88,42.43 30.88,43.7 31.36,44.18 JP8.7
  Bottom 0.406: SJ2.1 23.57,7.51 | 23.57,7.51 23.57,10.05 26.11,12.59 35,12.59 U$2.18/A4 | 23.57,7.51 15.95,7.51 14.68,8.78 14.68,16.4 | 14.68,16.4 14.68,19.57 14.05,20.21 12.78,20.21 12.14,20.84 12.14,22.75 JP7.3 15,25.6 15,28.46 16.91,30.37 25.8,30.37 26.75,30.37 v28.97,32.59 | 14.68,16.4 v13.41,16.4
TX1  (via drill 0.5)
  Top 0.406: v29.92,32.11 30.24,32.43 30.24,39.89 31.04,40.69 JP8.10
  Bottom 0.406: U$2.1 26.43,29.1 26.91,29.1 v29.92,32.11

### Text on the board
tNames: Brian C. / 2015